# EAGLE design fx2fpga (EAGLE 5.00)
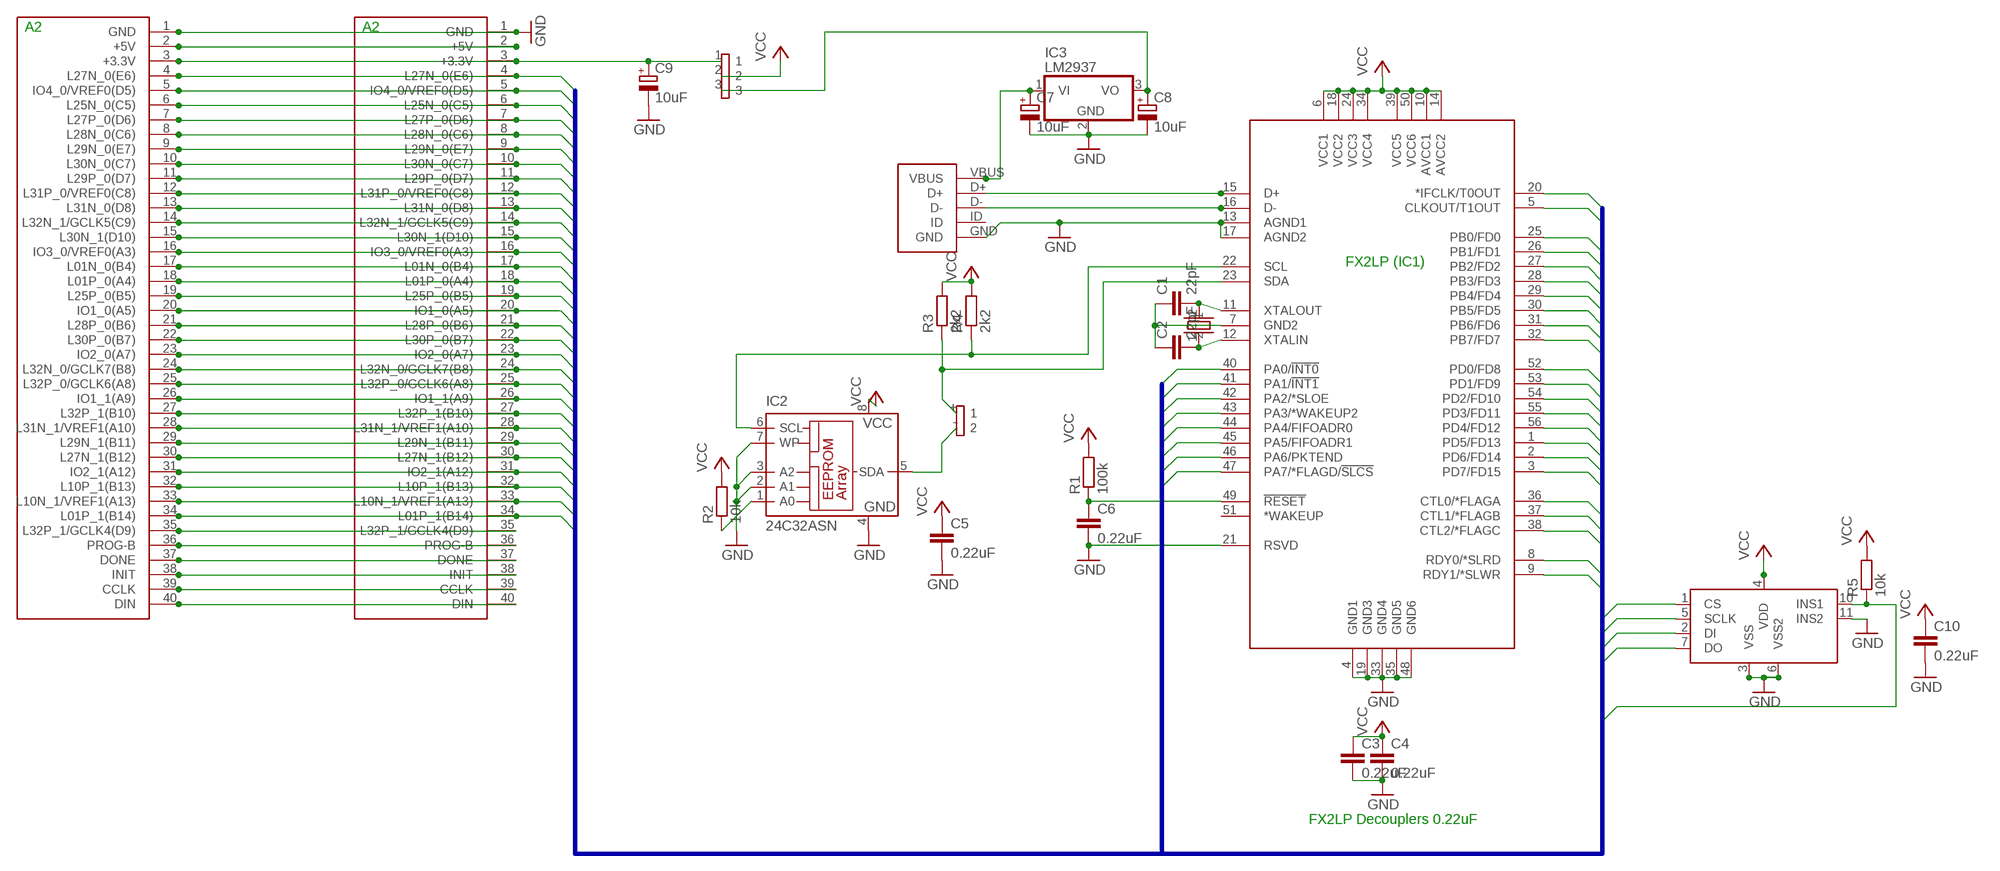
[diagram p0: schematic, sheet 1]

## Parts
C1  22pF  C-EUC0805  [C0805]
C2  22pF  C-EUC0805  [C0805]
C3  0.22uF  C-EUC0805  [C0805]
C4  0.22uF  C-EUC0805  [C0805]
C5  0.22uF  C-EUC0805  [C0805]
C6  0.22uF  C-EUC0805  [C0805]
C7  10uF  CPOL-EUCT3528  [CT3528]
C8  10uF  CPOL-EUCT3528  [CT3528]
C9  10uF  CPOL-EUCT3528  [CT3528]
C10  0.22uF  C-EUC0805  [C0805]
IC1  CY7C68014A-56PVXC  [SSOP56]
IC2  24C32ASN  [SO-08]
IC3  LM2937  [TO263-3]
R1  100k  R-EU_R0805  [R0805]
R2  10k  R-EU_R0805  [R0805]
R3  2k2  R-EU_R0805  [R0805]
R4  2k2  R-EU_R0805  [R0805]
R5  10k  R-EU_R0805  [R0805]
U$1  MOLEX-67955-8001-SD-CARD-SLOT  [MOLEX-67955-8001-SD-CARD-SLOT]
U$2  USB-MINI-B  [USB-MINI-B]
U$3  CRYSTALTH  [HC49/S]
U$4  2P  [2P1S]
U$5  DIGILENT_S3_A2  [IDC20X2]
U$6  3P  [3P1S]
U$7  DIGILENT_S3_A2  [IDC20X2]

## Nets
!RESET: C6.1 IC1.49(!RESET) R1.1
CLKOUT: IC1.5(CLKOUT/T1OUT) U$5.24(L32N_0/GCLK7(B8)) U$7.24(L32N_0/GCLK7(B8))
CTL0: IC1.36(CTL0/*FLAGA) U$5.12(L31P_0/VREF0(C8)) U$7.12(L31P_0/VREF0(C8))
CTL1: IC1.37(CTL1/*FLAGB) U$5.13(L31N_0(D8)) U$7.13(L31N_0(D8))
CTL2: IC1.38(CTL2/*FLAGC) U$5.15(L30N_1(D10)) U$7.15(L30N_1(D10))
FD0: IC1.25(PB0/FD0) U$5.4(L27N_0(E6)) U$7.4(L27N_0(E6))
FD1: IC1.26(PB1/FD1) U$5.5(IO4_0/VREF0(D5)) U$7.5(IO4_0/VREF0(D5))
FD2: IC1.27(PB2/FD2) U$5.6(L25N_0(C5)) U$7.6(L25N_0(C5))
FD3: IC1.28(PB3/FD3) U$5.7(L27P_0(D6)) U$7.7(L27P_0(D6))
FD4: IC1.29(PB4/FD4) U$5.8(L28N_0(C6)) U$7.8(L28N_0(C6))
FD5: IC1.30(PB5/FD5) U$5.9(L29N_0(E7)) U$7.9(L29N_0(E7))
FD6: IC1.31(PB6/FD6) U$5.10(L30N_0(C7)) U$7.10(L30N_0(C7))
FD7: IC1.32(PB7/FD7) U$5.11(L29P_0(D7)) U$7.11(L29P_0(D7))
GND: C3.2 C4.2 C5.2 C6.2 C7.- C8.- C9.- C10.2 IC1.4(GND1) IC1.13(AGND1) IC1.17(AGND2) IC1.19(GND3) IC1.21(RSVD) IC1.33(GND4) IC1.35(GND5) IC1.48(GND6) IC2.2(A1) IC2.3(A2) IC2.4(GND) IC2.7(WP) IC3.2(GND) U$1.3(VSS) U$1.6(VSS2) U$1.11(INS2) U$2.GND U$5.1(GND) U$7.1(GND)
IFCLK: IC1.20(*IFCLK/T0OUT) U$5.14(L32N_1/GCLK5(C9)) U$7.14(L32N_1/GCLK5(C9))
N$1: IC1.15(D+) U$2.D+
N$2: IC1.16(D-) U$2.D-
N$3: C1.2 IC1.11(XTALOUT) U$3.2
N$4: C2.2 IC1.12(XTALIN) U$3.1
N$5: C9.+ U$5.3(+3.3V) U$6.1 U$7.3(+3.3V)
N$6: IC2.1(A0) R2.1
N$7: C7.+ IC3.1(VI) U$2.VBUS
N$8: C8.+ IC3.3(VO) U$6.3
N$10: U$5.2(+5V) U$7.2(+5V)
N$11: U$5.35(L32P_1/GCLK4(D9)) U$7.35(L32P_1/GCLK4(D9))
N$12: U$5.36(PROG-B) U$7.36(PROG-B)
N$13: U$5.37(DONE) U$7.37(DONE)
N$14: U$5.38(INIT) U$7.38(INIT)
N$15: U$5.39(CCLK) U$7.39(CCLK)
N$16: U$5.40(DIN) U$7.40(DIN)
PA0: IC1.40(PA0/!INT0) U$5.16(IO3_0/VREF0(A3)) U$7.16(IO3_0/VREF0(A3))
PA1: IC1.41(PA1/!INT1) U$5.17(L01N_0(B4)) U$7.17(L01N_0(B4))
PA2: IC1.42(PA2/*SLOE) U$5.18(L01P_0(A4)) U$7.18(L01P_0(A4))
PA3: IC1.43(PA3/*WAKEUP2) U$5.19(L25P_0(B5)) U$7.19(L25P_0(B5))
PA4: IC1.44(PA4/FIFOADR0) U$5.20(IO1_0(A5)) U$7.20(IO1_0(A5))
PA5: IC1.45(PA5/FIFOADR1) U$5.21(L28P_0(B6)) U$7.21(L28P_0(B6))
PA6: IC1.46(PA6/PKTEND) U$5.22(L30P_0(B7)) U$7.22(L30P_0(B7))
PA7: IC1.47(PA7/*FLAGD/!SLCS) U$5.23(IO2_0(A7)) U$7.23(IO2_0(A7))
PD0: IC1.52(PD0/FD8) U$5.25(L32P_0/GCLK6(A8)) U$7.25(L32P_0/GCLK6(A8))
PD1: IC1.53(PD1/FD9) U$5.26(IO1_1(A9)) U$7.26(IO1_1(A9))
PD2: IC1.54(PD2/FD10) U$5.27(L32P_1(B10)) U$7.27(L32P_1(B10))
PD3: IC1.55(PD3/FD11) U$1.7(DO) U$5.28(L31N_1/VREF1(A10)) U$7.28(L31N_1/VREF1(A10))
PD4: IC1.56(PD4/FD12) R5.1 U$1.10(INS1) U$5.29(L29N_1(B11)) U$7.29(L29N_1(B11))
PD5: IC1.1(PD5/FD13) U$1.5(SCLK) U$5.30(L27N_1(B12)) U$7.30(L27N_1(B12))
PD6: IC1.2(PD6/FD14) U$1.2(DI) U$5.31(IO2_1(A12)) U$7.31(IO2_1(A12))
PD7: IC1.3(PD7/FD15) U$1.1(CS) U$5.32(L10P_1(B13)) U$7.32(L10P_1(B13))
RDY0: IC1.8(RDY0/*SLRD) U$5.33(L10N_1/VREF1(A13)) U$7.33(L10N_1/VREF1(A13))
RDY1: IC1.9(RDY1/*SLWR) U$5.34(L01P_1(B14)) U$7.34(L01P_1(B14))
SCL: IC1.22(SCL) IC2.6(SCL) R4.1
SDA_CPU: IC1.23(SDA) R3.1 U$4.+
SDA_ROM: IC2.5(SDA) U$4.-
VCC: C3.1 C4.1 C5.1 C10.1 IC1.6(VCC1) IC1.10(AVCC1) IC1.14(AVCC2) IC1.18(VCC2) IC1.24(VCC3) IC1.34(VCC4) IC1.39(VCC5) IC1.50(VCC6) IC2.8(VCC) R1.2 R2.2 R3.2 R4.2 R5.2 U$1.4(VDD) U$6.2
XTALGND: C1.1 C2.1 IC1.7(GND2)
Unconnected: IC1.51(*WAKEUP) U$2.ID

## Buses
PA[0..7],PD[0..7],FD[0..7],RDY[0..1],CTL[0..2],IFCLK,CLKOUT

## Notes on the sheet
- A2 | A2
- FX2LP (IC1)
- FX2LP Decouplers 0.22uF

## Library data of the parts
C1-C6 C10 = rcl:C-EU: CAPACITOR, European symbol
C7-C9 = rcl:CPOL-EU: POLARIZED CAPACITOR, European symbol
IC1 = umdk:CY7C68014A-56PVXC
IC2 = microchip:24*: Serial EEPROM I2C
IC3 = linear:LM2937: LM2937-2.5, LM2937-3.3 400mA and 500mA Voltage Regulators Source: http://cache.national.com/ds/LM/LM2937-2.5.pdf
R1-R5 = rcl:R-EU_: RESISTOR, European symbol
U$1 = chris:MOLEX-67955-8001-SD-CARD-SLOT
U$2 = chris:USB-MINI-B
U$3 = chris:CRYSTAL
U$4 = chris:2P
U$5 U$7 = chris:DIGILENT_S3_A2
U$6 = chris:3P

## Board
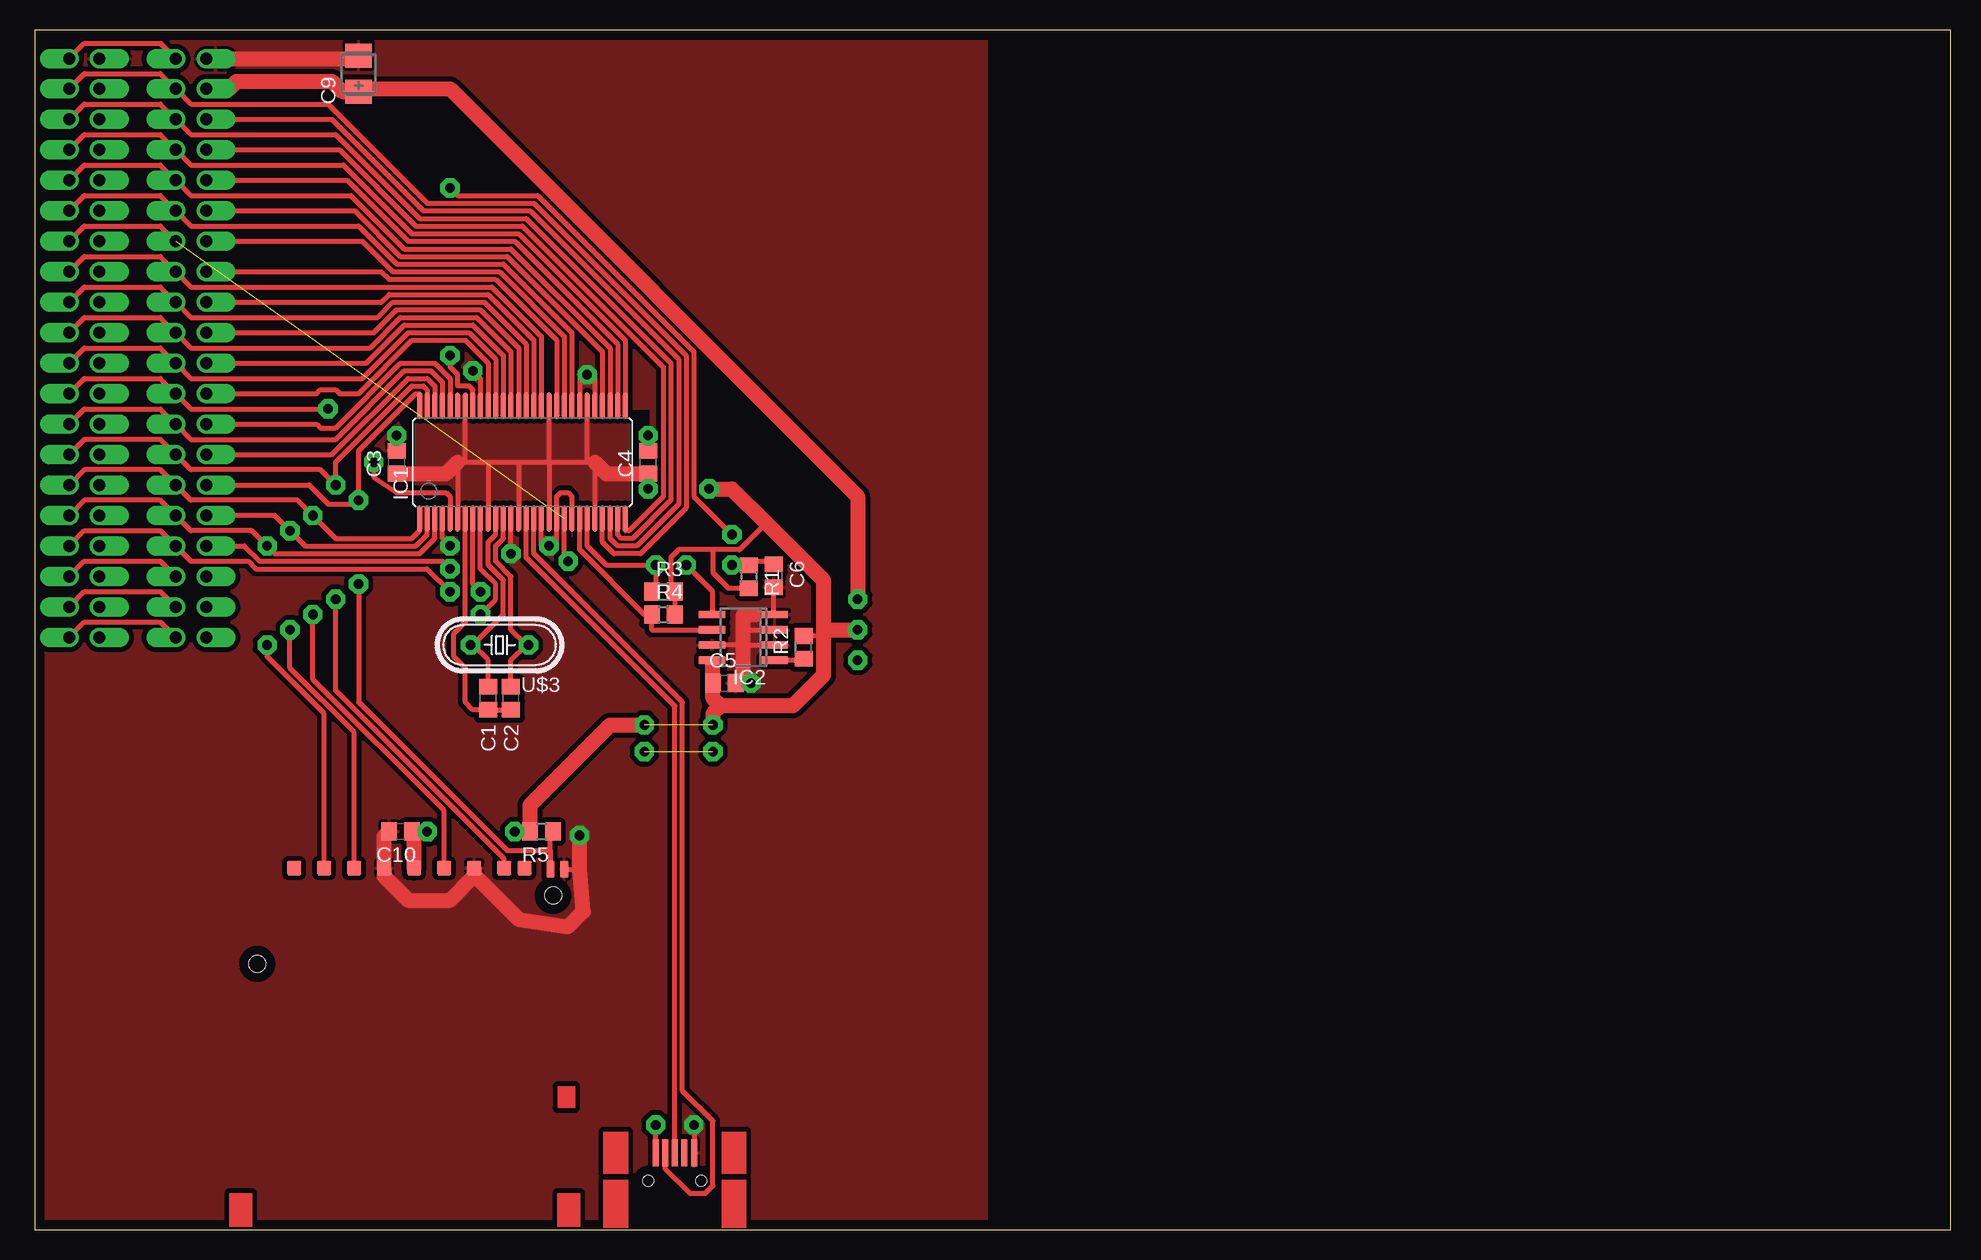
[diagram p1: board, top side]
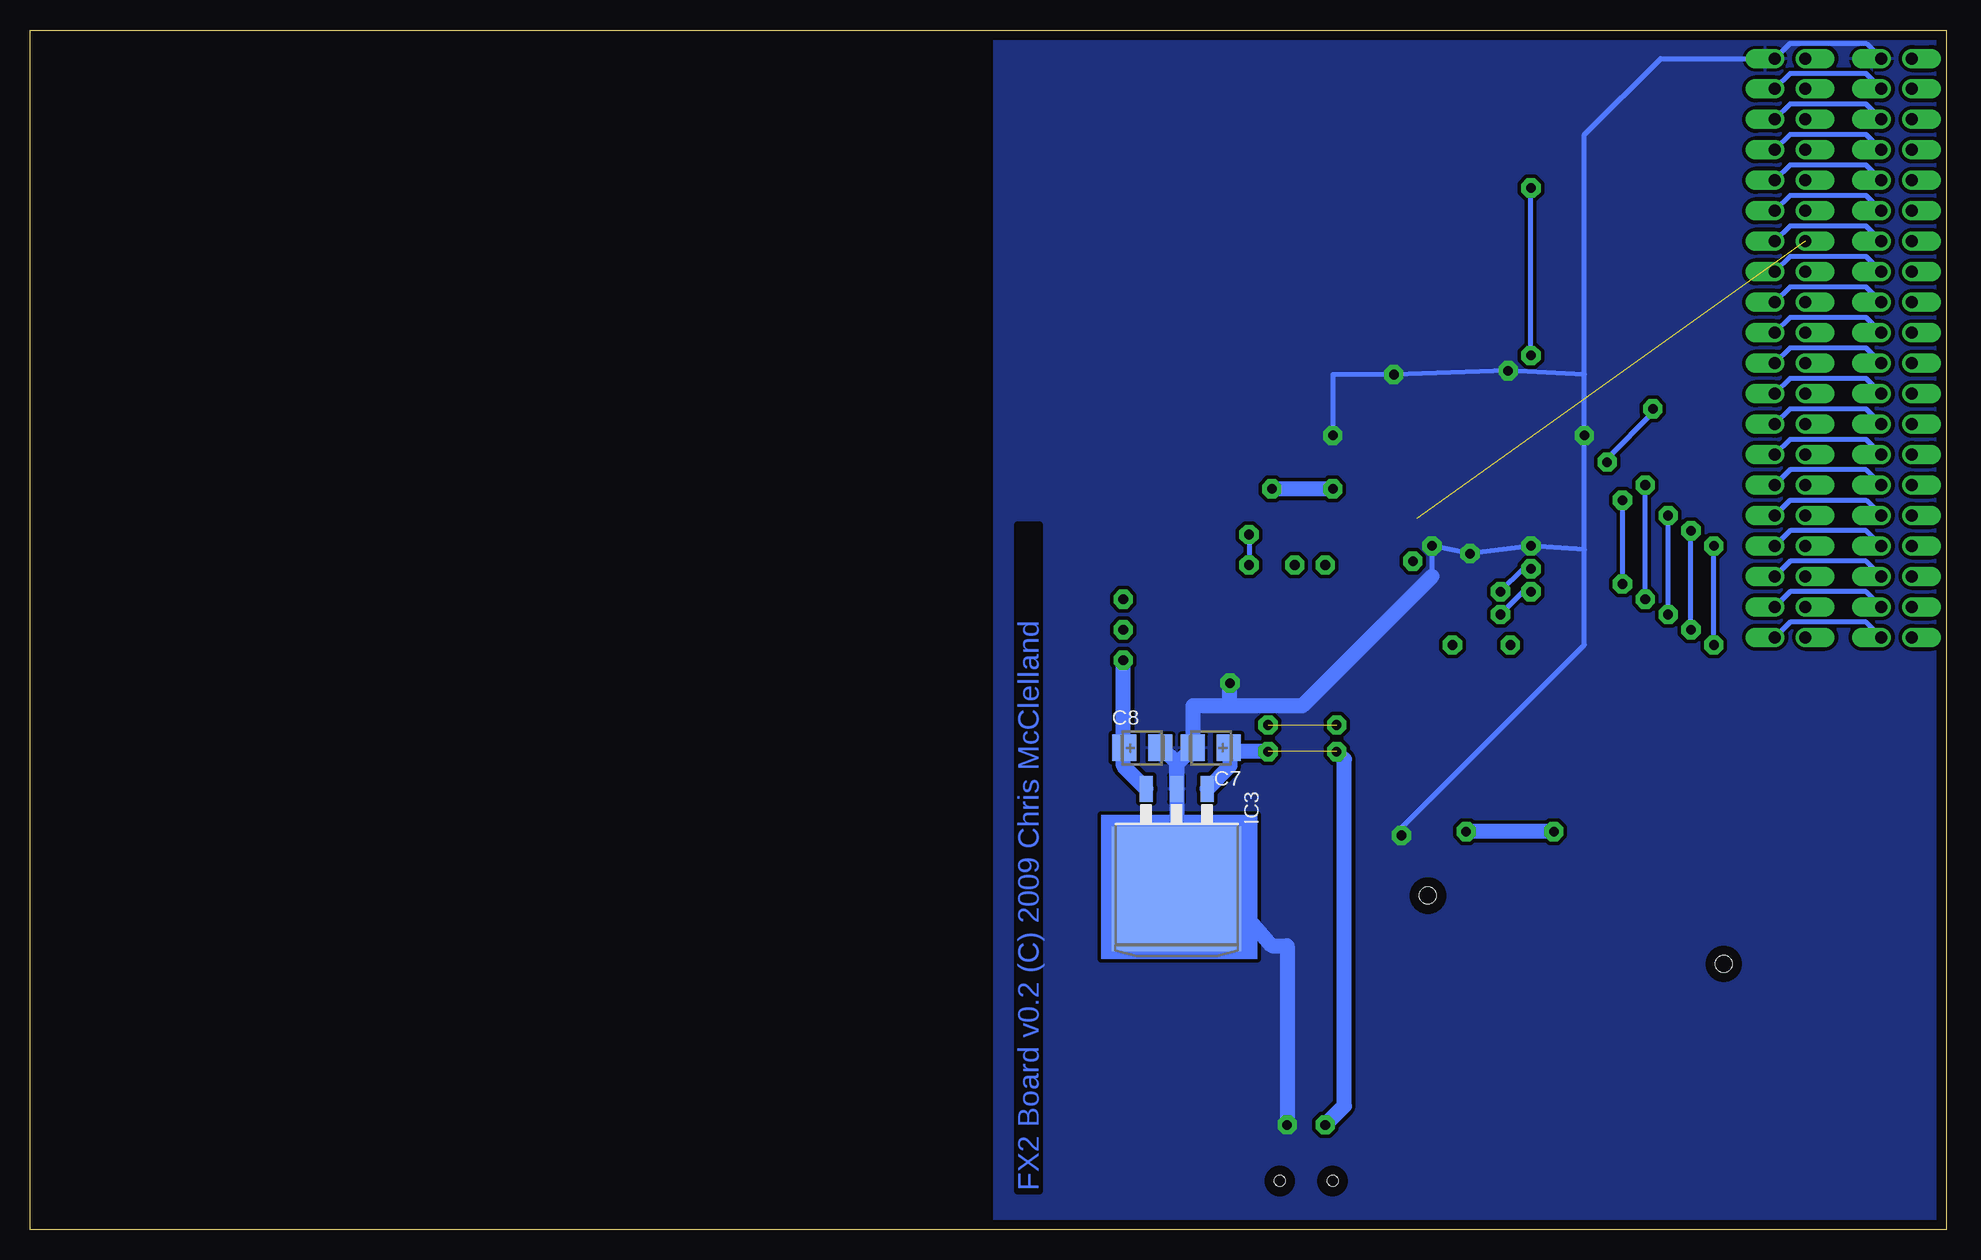
[diagram p2: board, bottom side, seen from below]

Size 159.68 x 100 mm. Coordinates in mm from the lower left corner, seen from the top.
Outline: 0,0 159.68,0 159.68,100 0,100 0,0
Copper layers (1+16): Top 0.035mm / dielectric 1.5mm / Bottom 0.035mm
Design rules "default": minimum track width 12mil, minimum drill 0.8mm, track to track 12mil, track to pad 12mil, pad to pad 11mil, via to via 12mil, smd to smd 8mil, copper to edge 32mil, drill to drill 16mil, minimum pad ring 10mil, minimum via ring 8mil, stop-mask expansion 4mil, vias tented up to drill 0mil, thermal gap 10mil

### Footprints (pad centres in the part's own frame; a part is rotated, then mirrored left to right if it is on the bottom)
C0805 = smd 1.3 x 1.5: 1 -0.95,0; 2 0.95,0
CT3528 = smd 2 x 2.2: + -1.5,0; - 1.5,0
SSOP56 = smd 2.2 x 0.4: 1 -4.7,0; 2 -4.7,-0.635; 3 -4.7,-1.27; 4 -4.7,-1.905; 5 -4.7,-2.54; 6 -4.7,-3.175; 7 -4.7,-3.81; 8 -4.7,-4.445; 9 -4.7,-5.08; 10 -4.7,-5.715; 11 -4.7,-6.35; 12 -4.7,-6.985; 13 -4.7,-7.62; 14 -4.7,-8.255; 15 -4.7,-8.89; 16 -4.7,-9.525; 17 -4.7,-10.16; 18 -4.7,-10.795; 19 -4.7,-11.43; 20 -4.7,-12.065; 21 -4.7,-12.7; 22 -4.7,-13.335; 23 -4.7,-13.97; 24 -4.7,-14.605; 25 -4.7,-15.24; 26 -4.7,-15.875; 27 -4.7,-16.51; 28 -4.7,-17.145; 29 4.7,-17.145; 30 4.7,-16.51; 31 4.7,-15.875; 32 4.7,-15.24; 33 4.7,-14.605; 34 4.7,-13.97; 35 4.7,-13.335; 36 4.7,-12.7; 37 4.7,-12.065; 38 4.7,-11.43; 39 4.7,-10.795; 40 4.7,-10.16; 41 4.7,-9.525; 42 4.7,-8.89; 43 4.7,-8.255; 44 4.7,-7.62; 45 4.7,-6.985; 46 4.7,-6.35; 47 4.7,-5.715; 48 4.7,-5.08; 49 4.7,-4.445; 50 4.7,-3.81; 51 4.7,-3.175; 52 4.7,-2.54; 53 4.7,-1.905; 54 4.7,-1.27; 55 4.7,-0.635; 56 4.7,0
SO-08 = smd 0.6 x 2.2: 1 -1.905,-2.6; 2 -0.635,-2.6; 3 0.635,-2.6; 4 1.905,-2.6; 5 1.905,2.6; 6 0.635,2.6; 7 -0.635,2.6; 8 -1.905,2.6
TO263-3 = smd 1.067 x 2.159: 1 -2.54,-5.791; 2 0,-5.791; 3 2.54,-5.791 | smd 10.8 x 10.41: TAB 0,2.54
R0805 = smd 1.3 x 1.5: 1 -0.95,0; 2 0.95,0
MOLEX-67955-8001-SD-CARD-SLOT = smd 1.2 x 1.2: 1 21.32,-29.92; 2 18.82,-29.92; 3 16.32,-29.92; 4 13.82,-29.92; 5 11.32,-29.92; 6 8.82,-29.92; 7 6.32,-29.92; 8 4.62,-29.92; 9 23.82,-29.92 | smd 0.7 x 1.4: 10 2.47,-29.82; 11 1.32,-29.82 | hole 1.4: 26.9,-21.92; 2.25,-27.62
USB-MINI-B = smd 2.25 x 0.5: D+ 6.25,0; D- 6.25,0.8; GND 6.25,-1.6; ID 6.25,-0.8; VBUS 6.25,1.6 | hole 0.9: 3.9,2.2; 3.9,-2.2
HC49/S = drill 0.8 pad 1.6 octagon: 1 -2.413,0; 2 2.413,0
2P1S = drill 0.8 pad 1.6 octagon: + 0,1.27; - 0,-1.27
IDC20X2 = drill 1 pad 1.626 offset: 1 2.54,2.54; 2 0,2.54; 3 2.54,0; 4 0,0; 5 2.54,-2.54; 6 0,-2.54; 7 2.54,-5.08; 8 0,-5.08; 9 2.54,-7.62; 10 0,-7.62; 11 2.54,-10.16; 12 0,-10.16; 13 2.54,-12.7; 14 0,-12.7; 15 2.54,-15.24; 16 0,-15.24; 17 2.54,-17.78; 18 0,-17.78; 19 2.54,-20.32; 20 0,-20.32; 21 2.54,-22.86; 22 0,-22.86; 23 2.54,-25.4; 24 0,-25.4; 25 2.54,-27.94; 26 0,-27.94; 27 2.54,-30.48; 28 0,-30.48; 29 2.54,-33.02; 30 0,-33.02; 31 2.54,-35.56; 32 0,-35.56; 33 2.54,-38.1; 34 0,-38.1; 35 2.54,-40.64; 36 0,-40.64; 37 2.54,-43.18; 38 0,-43.18; 39 2.54,-45.72; 40 0,-45.72
3P1S = drill 0.8 pad 1.6 octagon: 1 0,2.54; 2 0,0; 3 0,-2.54

### Placement (x,y rotation side)
C1  37.78,44.28 90 top
C2  39.68,44.28 90 top
C3  30.16,63.97 90 top
C4  51.11,63.97 90 top
C5  57.46,45.55 0 top
C6  61.59,54.49 270 top
C7  61.27,40.16 180 bottom
C8  66.99,40.16 0 bottom
C9  26.98,96.36 90 top
C10  30.48,33.17 180 top
IC1  32.06,63.97 90 top
IC2  59.05,49.37 90 top
IC3  64.13,30.95 180 bottom
R1  59.5,54.42 270 top
R2  64.06,48.53 90 top
R3  52.38,53.17 0 top
R4  52.38,51.27 0 top
R5  42.22,33.17 180 top
U$1  45.44,0.22 180 top
U$2  53.34,0.15 90 top
U$3  38.73,48.73 180 top
U$4  53.02,55.4 90 top
U$5  11.74,95.08 0 top
U$6  68.58,50 0 top
U$7  2.85,95.08 0 top

### Tracks (layer width: path | path; a pad name or v marks a point on that pad's centre or on a via)
!RESET  (via drill 0.8 pad 1.6)
  Top 0.406: IC1.49 36.51,70 36.19,70.32 35.24,70.32 35.24,71.27 34.6,71.91 v34.6,72.86 | v34.6,86.83 35.24,86.19 41.91,86.19 54.92,73.18 54.92,61.11 v58.1,57.94 | C6.1 61.59,55.4 61.27,55.71 59.84,55.71 R1.1 59.48,55.4 v58.1,55.4
  Bottom 0.406: v34.6,72.86 v34.6,86.83 | v58.1,57.94 v58.1,55.4
CLKOUT  (via drill 0.8 pad 1.6)
  Top 0.406: v28.25,63.97 28.25,62.7 30.16,61.43 34.28,61.43 34.6,61.11 IC1.5 34.6,59.21 | U$7.24 4.12,70.95 10.47,70.95 U$5.24 13.01,68.41 v24.44,68.41
  Bottom 0.406: v24.44,68.41 24.44,68.1 28.25,64.29 v28.25,63.97
CTL0
  Top 0.406: IC1.36 44.76,74.77 39.05,80.48 30.16,80.48 26.98,83.66 13.01,83.66 U$5.12 10.47,86.19 4.12,86.19 U$7.12
CTL1
  Top 0.406: IC1.37 44.13,74.45 38.73,79.84 29.84,79.84 27.3,82.39 U$5.13
  Bottom 0.406: U$7.13 6.66,83.66 13.01,83.66 U$5.13
CTL2
  Top 0.406: IC1.38 43.49,74.13 38.41,79.21 29.52,79.21 28.89,79.84 U$5.15
  Bottom 0.406: U$7.15 6.66,81.11 13.01,81.11 U$5.15
FD0
  Top 0.406: IC1.25 47.3,57.3 48.26,56.35 50.48,56.35 54.29,60.16 54.29,72.86 41.59,85.56 32.7,85.56 24.44,93.81 13.01,93.81 U$5.4 10.47,96.36 4.12,96.36 U$7.4
FD1
  Top 0.406: IC1.26 47.94,57.62 48.57,56.98 50.16,56.98 53.65,60.48 53.65,72.54 41.27,84.92 32.38,84.92 24.76,92.55 U$5.5
  Bottom 0.406: U$7.5 6.66,93.81 13.01,93.81 U$5.5
FD2
  Top 0.406: IC1.27 48.57,57.94 48.89,57.62 49.84,57.62 53.02,60.8 53.02,72.22 40.95,84.29 32.06,84.29 25.08,91.28 13.01,91.28 U$5.6 10.47,93.81 4.12,93.81 U$7.6
FD3
  Top 0.406: IC1.28 49.21,58.25 49.52,58.25 52.38,61.11 52.38,71.91 40.63,83.66 31.75,83.66 25.39,90 U$5.7
  Bottom 0.406: U$7.7 6.66,91.28 13.01,91.28 U$5.7
FD4
  Top 0.406: IC1.29 49.21,74.13 40.32,83.02 31.43,83.02 25.71,88.73 13.01,88.73 U$5.8 10.47,91.28 4.12,91.28 U$7.8
FD5
  Top 0.406: IC1.30 48.57,73.81 40,82.39 31.11,82.39 26.03,87.47 U$5.9
  Bottom 0.406: U$7.9 6.66,88.73 13.01,88.73 U$5.9
FD6
  Top 0.406: IC1.31 47.94,73.5 39.68,81.75 30.79,81.75 26.35,86.19 13.01,86.19 U$5.10 10.47,88.73 4.12,88.73 U$7.10
FD7
  Top 0.406: IC1.32 47.3,73.18 39.37,81.11 30.48,81.11 26.66,84.92 U$5.11
  Bottom 0.406: U$7.11 6.66,86.19 13.01,86.19 U$5.11
GND  (via drill 0.8 pad 1.6)
  Top 0.406: IC1.33 46.67,71.27 v46.03,71.27 45.4,71.27 IC1.35 | v36.51,71.59 37.14,70.95 IC1.48 | v34.6,56.98 33.97,57.62 IC1.4 | v30.16,66.19 C3.2 | v51.11,66.19 C4.2 | 44.76,59.21 IC1.21 44.76,61.11 44.45,61.43 43.81,61.43 43.49,61.11 IC1.19 43.49,56.98 v42.86,56.98 42.22,56.98 IC1.17 | 61.59,50 IC2.3 | 61.59,50 61.65,49.94 | 61.59,51.27 IC2.4 | IC2.7 59.05,48.73 IC2.2 | C6.2 61.59,53.5 61.59,53.49 61.59,51.27 | 59.05,45.55 C5.2 | 59.05,50 61.59,50 | 61.59,51.27 61.65,51.21 | 60,51.27 61.59,51.27 | 54.94,8.71 v54.92,8.73 54.94,8.73 U$2.GND | U$1.11 44.13,30 45.4,30 | v39.68,56.35 IC1.13
  Top 1.27: v59.69,45.55 59.05,45.55 59.05,48.73 59.05,50 59.05,51.27 60,51.27 | C10.2 29.12,32.77 U$1.3 29.12,29.45 31.11,27.46 34.6,27.46 36.62,29.47 U$1.6 36.62,29.57 40.32,25.87 44.45,25.23 45.72,26.5 45.4,30 v45.4,32.85 | C9.- 26.75,97.62 U$5.1
  Bottom 0.406: 30.16,71.27 v36.51,71.59 v46.03,71.27 51.11,71.27 v51.11,66.19 | 30.16,56.67 v34.6,56.98 v39.68,56.35 v42.86,56.98 42.86,54.45 | 30.16,56.67 v30.16,66.19 30.16,71.27 | 30.16,71.27 30.16,91.28 23.81,97.62 U$5.1 13.01,98.89 6.66,98.89 U$7.1 | v45.4,32.85 45.4,33.49 30.16,48.73 30.16,56.67
  Bottom 1.27: 42.86,54.45 53.65,43.65 59.69,43.65 | C8.- 65.4,40.16 64.13,38.89 IC3.2 | IC3.2 64.13,38.8 C7.- 62.77,43.65 59.69,43.65 | v54.92,8.73 54.92,23.65 56.19,23.65 64.13,32.85 IC3.2 | 59.69,43.65 v59.69,45.55
  pour Top (isolate 0.406): 0.31,99.47 0.31,64.47 30.31,64.47 30.31,68.47 51.31,68.47 51.31,59.47 30.31,59.47 30.31,63.47 0.31,63.47 0.31,0.47 79.31,0.47 79.31,99.47
  pour Bottom (isolate 0.305): 0.31,99.47 79.31,99.47 79.31,0.47 0.31,0.47
IFCLK  (via drill 0.8 pad 1.6)  (1 unrouted)
  Top 0.406: U$7.14 4.12,83.66 10.47,83.66 U$5.14 | IC1.20 44.13,56.03 v44.45,55.71
N$1
  Top 0.406: IC1.15 40.95,56.03 53.34,43.65 U$2.D+
N$2
  Top 0.406: IC1.16 41.59,56.35 53.97,43.97 53.97,11.58 56.51,9.04 56.51,3.64 55.87,3.01 54.6,3.01 52.53,5.08 U$2.D-
N$3
  Top 0.406: IC1.11 38.41,57.94 37.78,57.3 37.78,55.4 39.05,54.13 39.05,51.27 36.51,48.73 | 36.51,48.73 U$3.2 | C1.2 37.78,47.46 36.51,48.73
N$4
  Top 0.406: IC1.12 39.05,57.62 38.41,56.98 38.41,55.71 39.68,54.45 39.68,50 40.95,48.73 | 40.95,48.73 U$3.1 | C2.2 39.68,47.46 40.95,48.73
N$5
  Top 1.27: U$6.1 68.58,61.11 34.6,95.08 26.98,95.08 C9.+ 25.62,94.86 24.76,95.72 16.82,95.72 16.19,95.08 U$5.3
  Bottom 0.406: U$7.3 6.66,96.36 13.01,96.36 U$5.3
N$6
  Top 0.406: R2.1 64.06,47.53 64.13,47.46 IC2.1
N$7  (via drill 0.8 pad 1.6)  (1 unrouted)
  Top 0.406: U$2.VBUS 51.75,6.42 v51.75,8.73
  Bottom 1.27: 59.69,39.84 C7.+ | IC3.1 59.69,38.65 59.69,39.84 | v51.75,8.73 50.16,10.31 50.16,39.2 v50.8,39.84 | v56.51,39.84 59.69,39.84
N$8
  Bottom 1.27: IC3.3 68.58,38.65 68.58,40.16 | 68.58,40.16 C8.+ | 68.58,40.16 U$6.3
N$10
  Top 0.406: U$7.2 4.12,98.89 10.47,98.89 U$5.2
N$11
  Bottom 0.406: U$7.35 6.66,55.71 13.01,55.71 U$5.35
N$12
  Top 0.406: U$7.36 4.12,55.71 10.47,55.71 U$5.36
N$13
  Bottom 0.406: U$7.37 6.66,53.17 13.01,53.17 U$5.37
N$14
  Top 0.406: U$7.38 4.12,53.17 10.47,53.17 U$5.38
N$15
  Bottom 0.406: U$7.39 6.66,50.63 13.01,50.63 U$5.39
N$16
  Top 0.406: U$7.40 4.12,50.63 10.47,50.63 U$5.40
PA0
  Top 0.406: IC1.40 42.22,74.45 38.09,78.58 13.01,78.58 U$5.16 10.47,81.11 4.12,81.11 U$7.16
PA1
  Top 0.406: IC1.41 41.59,74.13 37.78,77.94 29.52,77.94 28.89,77.3 U$5.17
  Bottom 0.406: U$7.17 6.66,78.58 13.01,78.58 U$5.17
PA2
  Top 0.406: IC1.42 40.95,73.81 37.46,77.3 29.84,77.3 28.57,76.03 13.01,76.03 U$5.18 10.47,78.58 4.12,78.58 U$7.18
PA3
  Top 0.406: IC1.43 40.32,73.5 37.14,76.67 30.16,76.67 28.25,74.77 U$5.19
  Bottom 0.406: U$7.19 6.66,76.03 13.01,76.03 U$5.19
PA4
  Top 0.406: IC1.44 39.68,73.18 36.83,76.03 30.48,76.03 27.93,73.5 13.01,73.5 U$5.20 10.47,76.03 4.12,76.03 U$7.20
PA5
  Top 0.406: IC1.45 39.05,72.86 36.51,75.4 30.79,75.4 27.62,72.22 U$5.21
  Bottom 0.406: U$7.21 6.66,73.5 13.01,73.5 U$5.21
PA6
  Top 0.406: IC1.46 38.41,72.54 36.19,74.77 31.11,74.77 27.3,70.95 13.01,70.95 U$5.22 10.47,73.5 4.12,73.5 U$7.22
PA7
  Top 0.406: IC1.47 37.78,72.22 35.87,74.13 31.43,74.13 26.98,69.69 25.39,69.69 25.08,70 23.81,70 23.49,69.69 U$5.23
  Bottom 0.406: U$7.23 6.66,70.95 13.01,70.95 U$5.23
PD0
  Top 0.406: IC1.52 34.6,70.95 33.33,72.22 30.48,72.22 25.08,66.83 23.81,66.83 23.49,67.14 U$5.25
  Bottom 0.406: U$7.25 6.66,68.41 13.01,68.41 U$5.25
PD1
  Top 0.406: IC1.53 33.97,70.64 33.02,71.59 30.79,71.59 25.08,65.88 13.01,65.88 U$5.26 10.47,68.41 4.12,68.41 U$7.26
PD2
  Top 0.406: IC1.54 33.33,70.32 32.7,70.95 31.11,70.95 24.76,64.61 U$5.27
  Bottom 0.406: U$7.27 6.66,65.88 13.01,65.88 U$5.27
PD3  (via drill 0.8 pad 1.6)
  Top 0.406: IC1.55 32.7,70 32.38,70.32 31.43,70.32 25.08,63.97 v25.08,62.06 23.81,63.34 13.01,63.34 U$5.28 10.47,65.88 4.12,65.88 U$7.28 | U$1.7 39.12,30.88 25.08,44.92 v25.08,52.54
  Bottom 0.406: v25.08,52.54 v25.08,62.06
PD4  (via drill 0.8 pad 1.6)
  Top 0.406: IC1.56 32.06,69.69 31.75,69.69 26.98,64.92 v26.98,60.8 26.66,60.48 24.44,60.48 22.86,62.06 U$5.29 | v26.98,53.81 26.98,43.97 39.37,31.58 42.97,31.58 | R5.1 42.86,32.85 42.97,32.74 42.97,31.58 | 42.97,31.58 U$1.10
  Bottom 0.406: U$7.29 6.66,63.34 13.01,63.34 U$5.29 | v26.98,60.8 v26.98,53.81
PD5  (via drill 0.8 pad 1.6)
  Top 0.406: IC1.1 32.06,58.25 31.43,57.62 25.08,57.62 v23.17,59.52 21.9,60.8 13.01,60.8 U$5.30 10.47,63.34 4.12,63.34 U$7.30 | U$1.5 34.12,34.92 23.17,45.87 v23.17,51.27
  Bottom 0.406: v23.17,51.27 v23.17,59.52
PD6  (via drill 0.8 pad 1.6)
  Top 0.406: IC1.2 32.7,57.94 31.75,56.98 22.54,56.98 v21.27,58.25 20,59.52 U$5.31 | U$1.2 26.62,41.47 21.27,46.82 v21.27,50
  Bottom 0.406: U$7.31 6.66,60.8 13.01,60.8 U$5.31 | v21.27,50 v21.27,58.25
PD7  (via drill 0.8 pad 1.6)
  Top 0.406: IC1.3 33.33,57.62 32.06,56.35 20,56.35 v19.36,56.98 18.09,58.25 13.01,58.25 U$5.32 10.47,60.8 4.12,60.8 U$7.32 | U$1.1 24.12,43.02 19.36,47.78 v19.36,48.73
  Bottom 0.406: v19.36,48.73 v19.36,56.98
RDY0  (via drill 0.8 pad 1.6)
  Top 0.406: IC1.8 36.51,53.81 v37.14,53.17 | v34.6,55.08 33.97,55.71 18.73,55.71 17.46,56.98 U$5.33
  Bottom 0.406: v37.14,53.17 35.24,55.08 v34.6,55.08 | U$7.33 6.66,58.25 13.01,58.25 U$5.33
RDY1  (via drill 0.8 pad 1.6)
  Top 0.406: IC1.9 37.14,55.08 38.41,53.81 38.41,52.54 v37.14,51.27 | v34.6,53.17 32.7,55.08 18.41,55.08 17.77,55.71 13.01,55.71 U$5.34 10.47,58.25 4.12,58.25 U$7.34
  Bottom 0.406: v37.14,51.27 35.24,53.17 v34.6,53.17
SCL
  Top 0.406: IC1.22 45.4,56.67 50.8,51.27 R4.1 51.43,50 IC2.6 56.51,50
SDA_CPU
  Top 0.406: IC1.23 46.03,56.98 47.62,55.4 U$4.+ 51.75,53.17 R3.1
SDA_ROM
  Top 0.406: IC2.5 56.45,53.23 U$4.-
VCC  (via drill 0.8 pad 1.6)  (1 unrouted)
  Top 0.406: IC1.24 46.67,63.97 46.03,63.97 | 42.86,63.97 46.03,63.97 | 40.32,63.97 42.86,63.97 | 37.78,63.97 40.32,63.97 | 35.87,63.97 37.78,63.97 | 35.87,63.97 35.24,63.97 IC1.6 | 46.03,63.97 IC1.34 | 35.87,63.97 IC1.50 | 37.78,63.97 IC1.10 | 40.32,63.97 IC1.14 | 42.86,63.97 IC1.18 | 42.86,63.97 IC1.39 | C4.1 v51.11,61.75 | 63.81,49.55 R2.2 65.61,49.48 65.72,49.37 | R3.2 | R3.2 53.02,53.17 53.02,53.18 53.02,56.03 53.65,56.67 56.51,56.67 | R3.2 R4.2 | R1.2 57.8,53.48 56.51,54.76 56.51,56.67 | IC2.8 56.51,47.4 56.51,47.14 | 56.51,56.67 58.73,56.67 60.95,58.89
  Top 1.27: C4.1 47.62,63.02 46.67,63.97 | C3.1 34.29,63.02 35.24,63.97 | C5.1 | C5.1 56.51,47.14 | C5.1 56.51,44.28 57.15,43.65 | 57.15,43.65 63.18,43.65 65.72,46.19 65.72,49.37 65.72,50 | 65.72,50 65.72,54.13 60.95,58.89 58.1,61.75 v56.19,61.75 | 65.72,50 U$6.2 | C10.1 | U$1.4 31.62,32.98 C10.1 | 57.15,43.65 56.51,43.02 v56.51,42.06 | R5.2 | v50.8,42.06 47.94,42.06 41.27,35.39 R5.2 | C10.1 v32.7,33.17 | v40,33.17 R5.2
  Bottom 1.27: v51.11,61.75 v56.19,61.75 | v32.7,33.17 v40,33.17
  pour Top (isolate 0.406): 31.75,67.14 31.75,60.8 49.52,60.8 49.52,67.14
XTALGND
  Top 0.406: C1.1 | C2.1 C1.1 | C1.1 | C1.1 36.51,43.33 35.87,43.97 35.87,46.82 34.92,47.78 34.92,49.68 35.87,50.63 IC1.7
(copper drawn outside any net)
  shapes: Bottom area x1

### Text on the board
Bottom: FX2 Board v0.2 (C) 2009 Chris McClelland